# Altium schematic sheet PowerSupply.SchDoc (part 1 of 3)
size A3
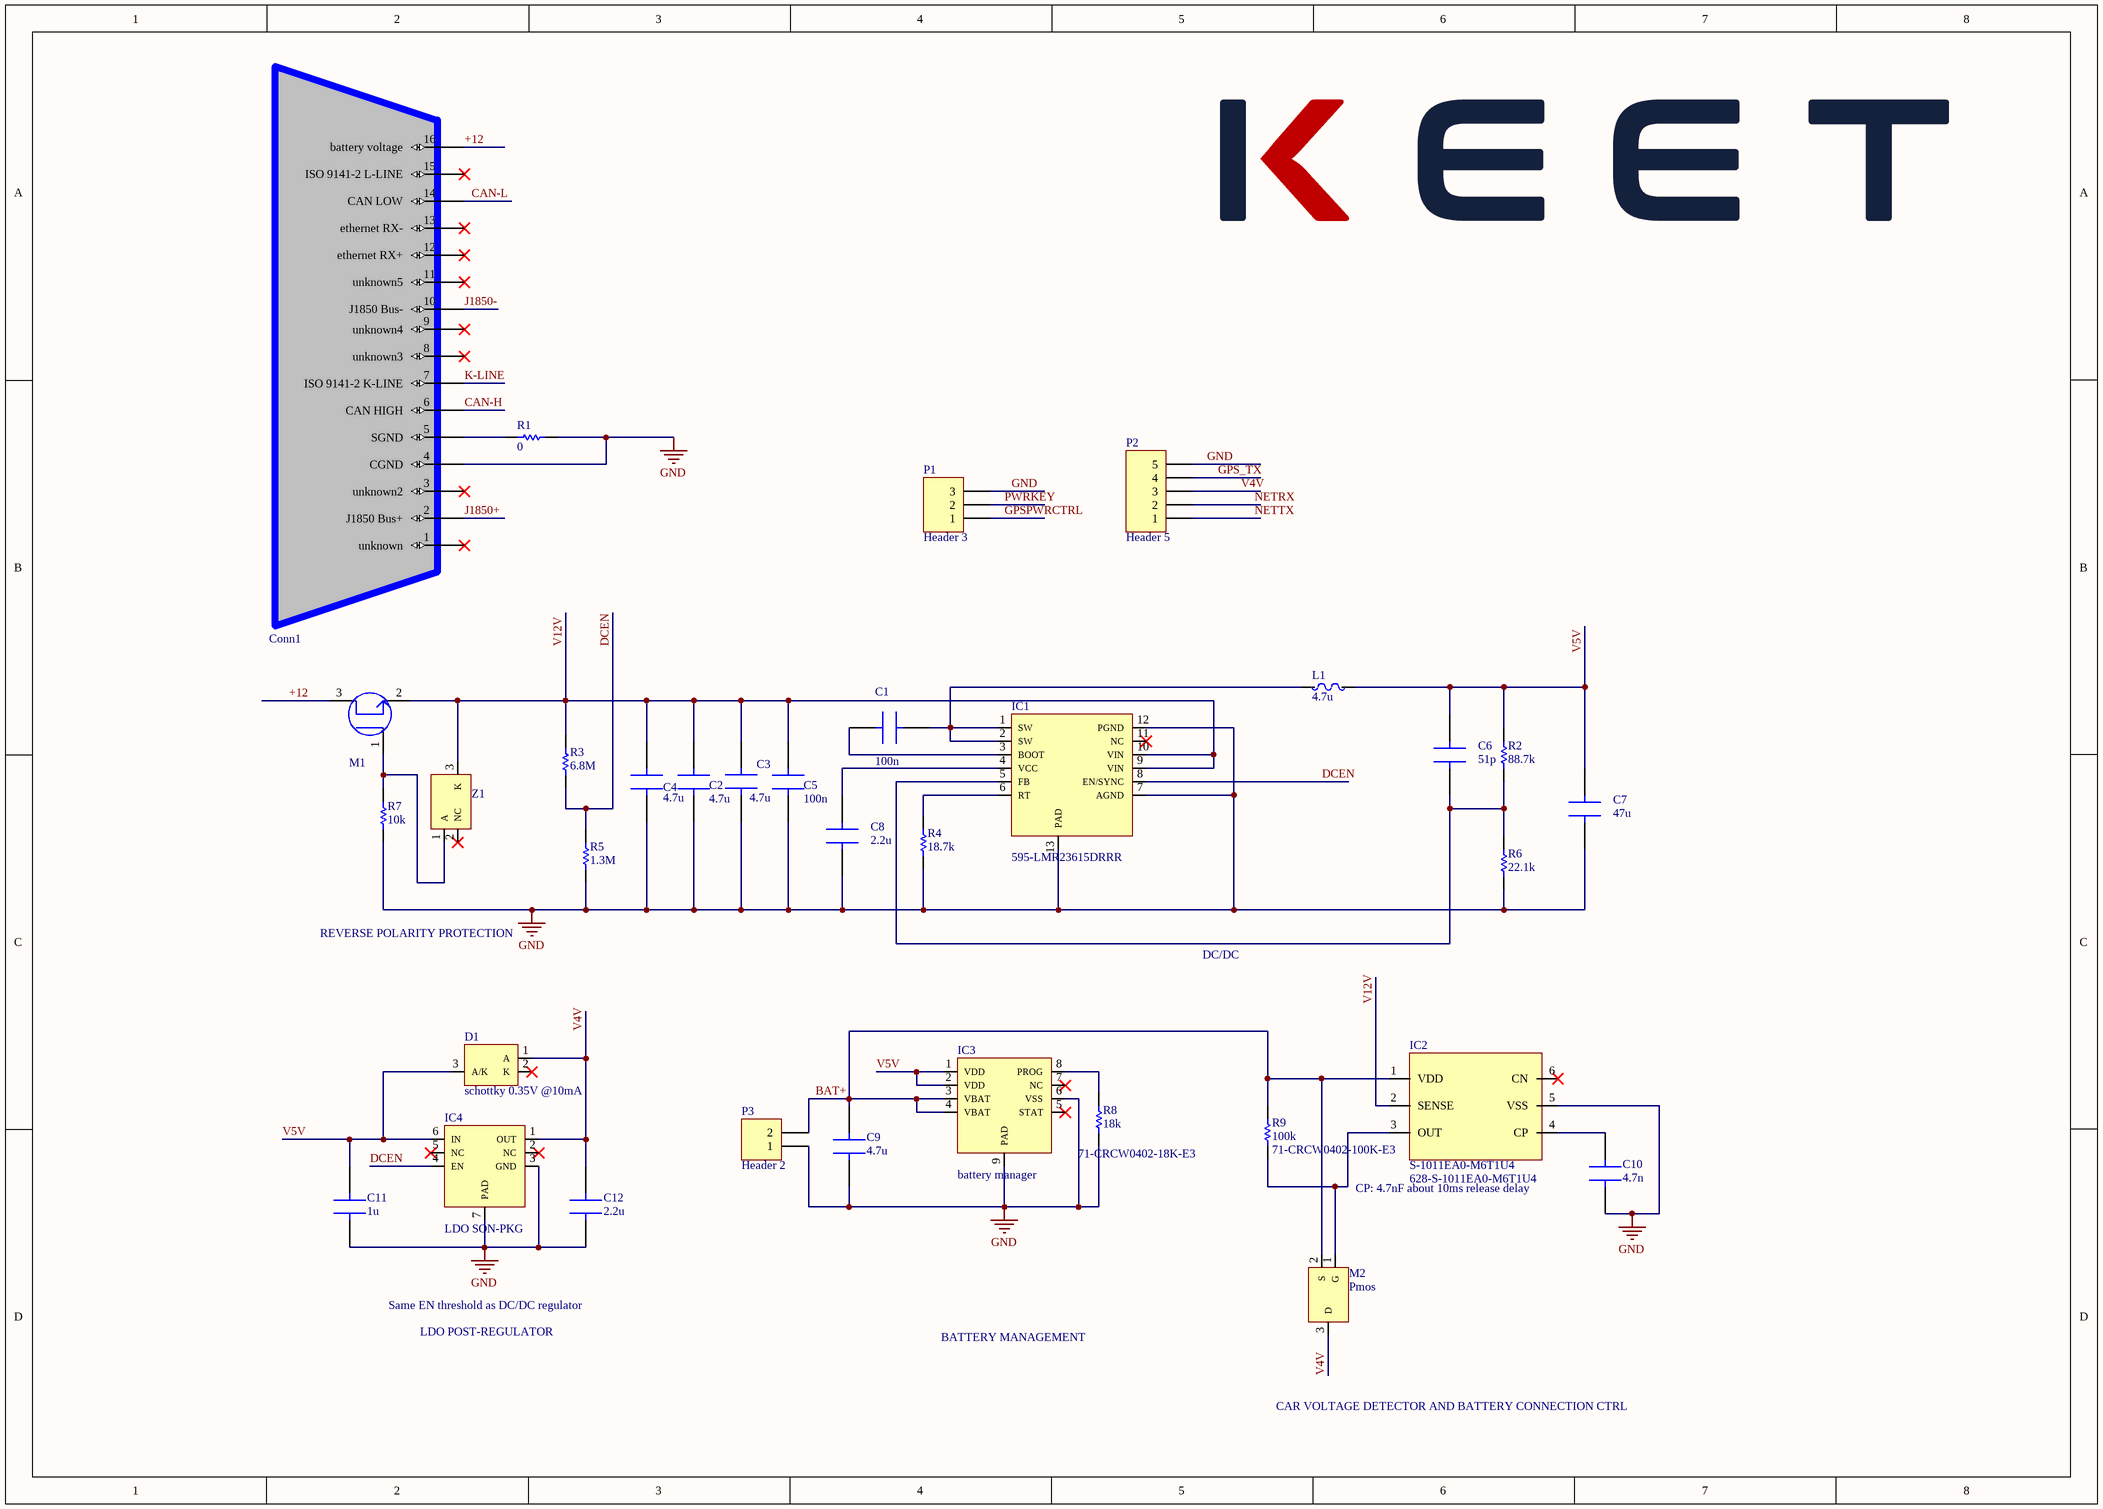
[diagram p0: PowerSupply.SchDoc]

## Parts
C1  100n  [CAPC1005X06N]
C2  4.7u  [CAPC1608X10N]
C3  4.7u  [CAPC1608X10N]
C4  4.7u  [CAPC1608X10N]
C5  100n  [CAPC1005X06N]
C6  51p  [CAPC1005X06N]
C7  47u  [CAPC3216X12N]
C8  2.2u  [CAPC1608X10N]
C9  4.7u  [CAPC1005X06N]
C10  4.7n  [CAPC1005X06N]
C11  1u  [CAPC1005X06N]
C12  2.2u  [CAPC1005X06N]
Conn1  OBD2 connector  [OBD2]  (value not drawn)
D1  schottky 0.35V @10mA  [SOT95P245X110-3N]
IC1  Supplier Part Number 1: 595-LMR23615DRRR  [SON50P300X80_HS-13N]  (hidden comment: DC/DC)
IC2  S-1011EA0-M6T1U4  Supplier Part Number 1: 628-S-1011EA0-M6T1U4  [SOT95P245X110-6N]
IC3  battery manager  [PSON50P300X100_HS-9N]
IC4  LDO SON-PKG  [SON65P200X80_HS-7N]
L1  4.7u  [INDC4040X19N]
M1  Pmos enhancement  [SOT95P245X110-3N]  (value not drawn)
M2  Pmos  [SOT95P245X110-3N]
P1  Header 3  [HDR1X3]
P2  Header 5  [HDR1X5]
P3  Header 2  [HDR1X2]
R1  0  [RESC1608X04N]
R2  88.7k  [RESC1005X04N]
R3  6.8M  [RESC1005X04N]
R4  18.7k  [RESC1005X04N]
R5  1.3M  [RESC1005X04N]
R6  22.1k  [RESC1005X04N]
R7  10k  [RESC1005X04N]
R8  18k  Supplier Part Number 1: 71-CRCW0402-18K-E3  [RESC1005X04N]
R9  100k  Supplier Part Number 1: 71-CRCW0402-100K-E3  [RESC1005X04N]
Z1  zener 10V  [SOT95P245X110-3N]  (value not drawn)

## Nets
GND: C2.1 C3.2 C4.1 C5.1 C7.1 C8.1 C9.1 C10.1 C11.2 C12.2 Conn1.4(CGND) IC1.7(AGND) IC1.12(PGND) IC1.13(PAD) IC2.5(VSS) IC3.6(VSS) IC3.9(PAD) IC4.3(GND) IC4.7(PAD) P1.3 P2.5 P3.1 R1.2 R4.1 R5.1 R6.1 R7.1 R8.1
+12: Conn1.16(battery_voltage) M1.3
BAT+: C9.2 IC2.1(VDD) IC3.3(VBAT) IC3.4(VBAT) M2.2(S) P3.2 R9.1
CAN-H: Conn1.6(CAN_HIGH)
CAN-L: Conn1.14(CAN_LOW)
DCEN: IC1.8(EN/SYNC) IC4.4(EN) R3.1 R5.2
GPS_TX: P2.4
GPSPWRCTRL: P1.1
J1850+: Conn1.2(J1850_Bus+)
J1850-: Conn1.10(J1850_Bus-)
K-LINE: Conn1.7(ISO_9141-2_K-LINE)
NETRX: P2.2
NETTX: P2.1
PWRKEY: P1.2
V4V: C12.1 D1.1(A) IC4.1(OUT) M2.3(D) P2.3
V5V: C6.2 C7.2 C11.1 D1.3(A/K) IC3.1(VDD) IC3.2(VDD) IC4.6(IN) L1.2 R2.2
V12V: C2.2 C3.1 C4.2 C5.2 IC1.9(VIN) IC1.10(VIN) IC2.2(SENSE) M1.2 R3.2 Z1.3(K)
NetC1_1: C1.1 IC1.3(BOOT)
NetC1_2: C1.2 IC1.1(SW) IC1.2(SW) L1.1
NetC6_1: C6.1 IC1.5(FB) R2.1 R6.2
NetC8_2: C8.2 IC1.4(VCC)
NetC10_2: C10.2 IC2.4(CP)
NetConn1_5: Conn1.5(SGND) R1.1
NetIC1_6: IC1.6(RT) R4.2
NetIC2_3: IC2.3(OUT) M2.1(G) R9.2
NetIC3_8: IC3.8(PROG) R8.2
NetM1_1: M1.1 R7.2 Z1.1(A)

Not connected (* = marked no-connect by the designer): Conn1 1(unknown)* 3(unknown2)* 8(unknown3)* 9(unknown4)* 11(unknown5)* 12(ethernet_RX+)* 13(ethernet_RX-)* 15(ISO_9141-2_L-LINE)*; D1 2(K)*; IC1 11(NC)*; IC2 6(CN)*; IC3 5(STAT)* 7(NC)*; IC4 2(NC)* 5(NC)*; Z1 2(NC)*

## Notes on the sheet
- REVERSE POLARITY PROTECTION
- DC/DC
- CP: 4.7nF about 10ms release delay
- Same EN threshold as DC/DC regulator
- LDO POST-REGULATOR
- BATTERY MANAGEMENT
- CAR VOLTAGE DETECTOR AND BATTERY CONNECTION CTRL